# Altium schematic sheet top.SchDoc
size C; SheetNumber: 1; SheetTotal: 3
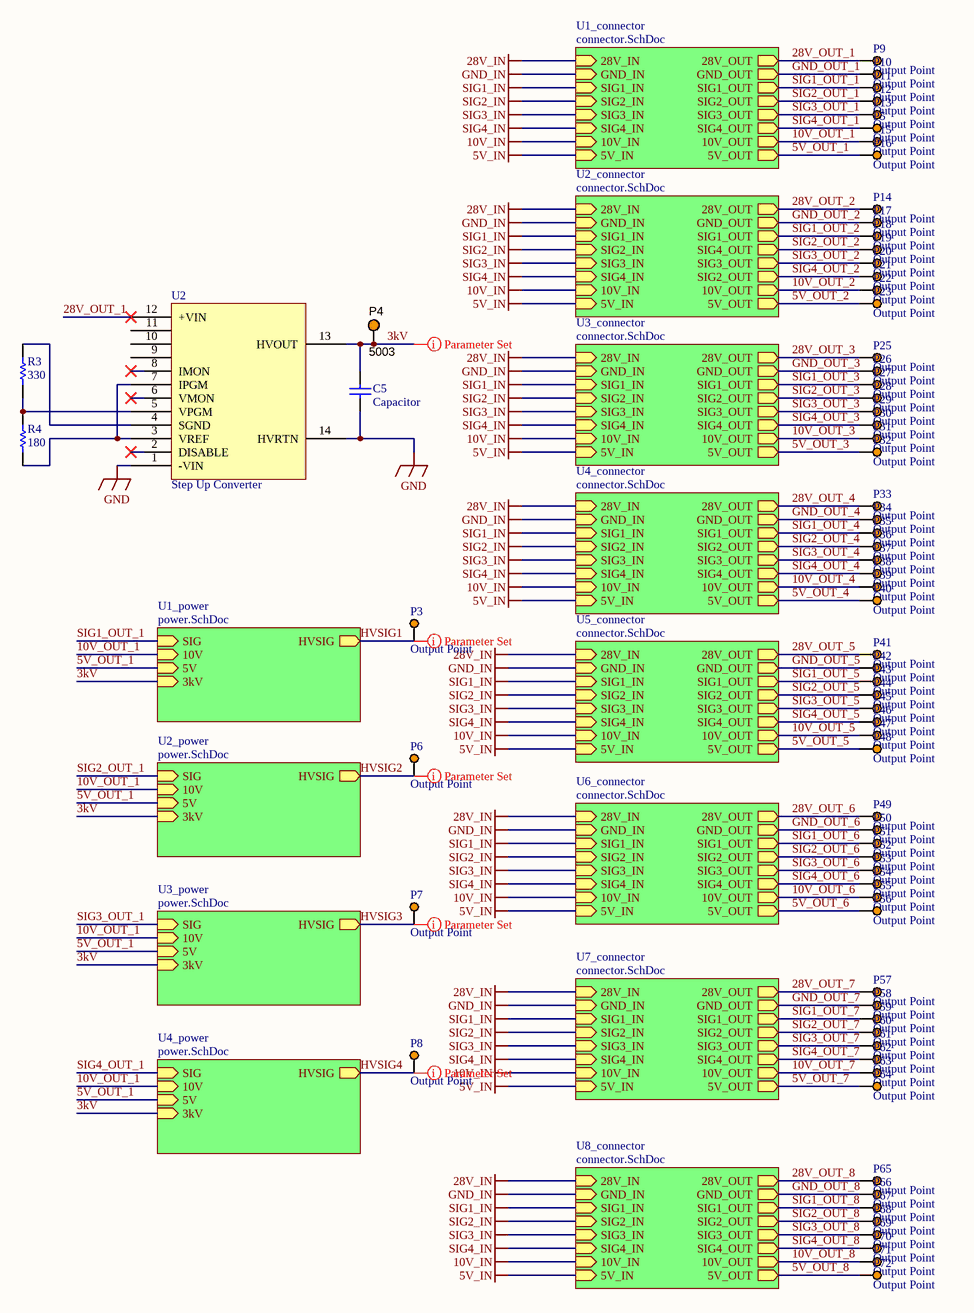
[diagram p0: top.SchDoc]

## Parts
C5  Capacitor  [HV Capacitor]
P3  Output Point  [Via]
P4  5003  [KSTN-5003]
P5  Output Point  [Via]
P6  Output Point  [Via]
P7  Output Point  [Via]
P8  Output Point  [Via]
P9  Output Point  [Via]
P10  Output Point  [Via]
P11  Output Point  [Via]
P12  Output Point  [Via]
P13  Output Point  [Via]
P14  Output Point  [Via]
P15  Output Point  [Via]
P16  Output Point  [Via]
P17  Output Point  [Via]
P18  Output Point  [Via]
P19  Output Point  [Via]
P20  Output Point  [Via]
P21  Output Point  [Via]
P22  Output Point  [Via]
P23  Output Point  [Via]
P25  Output Point  [Via]
P26  Output Point  [Via]
P27  Output Point  [Via]
P28  Output Point  [Via]
P29  Output Point  [Via]
P30  Output Point  [Via]
P31  Output Point  [Via]
P32  Output Point  [Via]
P33  Output Point  [Via]
P34  Output Point  [Via]
P35  Output Point  [Via]
P36  Output Point  [Via]
P37  Output Point  [Via]
P38  Output Point  [Via]
P39  Output Point  [Via]
P40  Output Point  [Via]
P41  Output Point  [Via]
P42  Output Point  [Via]
P43  Output Point  [Via]
P44  Output Point  [Via]
P45  Output Point  [Via]
P46  Output Point  [Via]
P47  Output Point  [Via]
P48  Output Point  [Via]
P49  Output Point  [Via]
P50  Output Point  [Via]
P51  Output Point  [Via]
P52  Output Point  [Via]
P53  Output Point  [Via]
P54  Output Point  [Via]
P55  Output Point  [Via]
P56  Output Point  [Via]
P57  Output Point  [Via]
P58  Output Point  [Via]
P59  Output Point  [Via]
P60  Output Point  [Via]
P61  Output Point  [Via]
P62  Output Point  [Via]
P63  Output Point  [Via]
P64  Output Point  [Via]
P65  Output Point  [Via]
P66  Output Point  [Via]
P67  Output Point  [Via]
P68  Output Point  [Via]
P69  Output Point  [Via]
P70  Output Point  [Via]
P71  Output Point  [Via]
P72  Output Point  [Via]
R3  330  [330 Ohm]
R4  180  [180 Ohm]
U2  Step Up Converter  [Step Up Converter]

## Sub-sheets
U1_connector = connector.SchDoc: 28V_IN (in), GND_IN (in), SIG1_IN (in), SIG2_IN (in), SIG3_IN (in), SIG4_IN (in), 10V_IN (in), 5V_IN (in), 28V_OUT (out), GND_OUT (out), SIG1_OUT (out), SIG2_OUT (out), SIG3_OUT (out), SIG4_OUT (out), 10V_OUT (out), 5V_OUT (out)
U1_power = power.SchDoc: SIG (in), 10V (in), 5V (in), HVSIG (out), 3kV (in)
U2_connector = connector.SchDoc: 28V_IN (in), GND_IN (in), SIG1_IN (in), SIG2_IN (in), SIG3_IN (in), SIG4_IN (in), 10V_IN (in), 5V_IN (in), 28V_OUT (out), GND_OUT (out), SIG1_OUT (out), SIG4_OUT (out), SIG3_OUT (out), SIG2_OUT (out), 10V_OUT (out), 5V_OUT (out)
U2_power = power.SchDoc: SIG (in), 10V (in), 5V (in), HVSIG (out), 3kV (in)
U3_connector = connector.SchDoc: 28V_IN (in), GND_IN (in), SIG1_IN (in), SIG2_IN (in), SIG3_IN (in), SIG4_IN (in), 10V_IN (in), 5V_IN (in), 28V_OUT (out), GND_OUT (out), SIG1_OUT (out), SIG2_OUT (out), SIG3_OUT (out), SIG4_OUT (out), 10V_OUT (out), 5V_OUT (out)
U3_power = power.SchDoc: SIG (in), 10V (in), 5V (in), HVSIG (out), 3kV (in)
U4_connector = connector.SchDoc: 28V_IN (in), GND_IN (in), SIG1_IN (in), SIG2_IN (in), SIG3_IN (in), SIG4_IN (in), 10V_IN (in), 5V_IN (in), 28V_OUT (out), GND_OUT (out), SIG1_OUT (out), SIG2_OUT (out), SIG3_OUT (out), SIG4_OUT (out), 10V_OUT (out), 5V_OUT (out)
U4_power = power.SchDoc: SIG (in), 10V (in), 5V (in), HVSIG (out), 3kV (in)
U5_connector = connector.SchDoc: 28V_IN (in), GND_IN (in), SIG1_IN (in), SIG2_IN (in), SIG3_IN (in), SIG4_IN (in), 10V_IN (in), 5V_IN (in), 28V_OUT (out), GND_OUT (out), SIG1_OUT (out), SIG2_OUT (out), SIG3_OUT (out), SIG4_OUT (out), 10V_OUT (out), 5V_OUT (out)
U6_connector = connector.SchDoc: 28V_IN (in), GND_IN (in), SIG1_IN (in), SIG2_IN (in), SIG3_IN (in), SIG4_IN (in), 10V_IN (in), 5V_IN (in), 28V_OUT (out), GND_OUT (out), SIG1_OUT (out), SIG2_OUT (out), SIG3_OUT (out), SIG4_OUT (out), 10V_OUT (out), 5V_OUT (out)
U7_connector = connector.SchDoc: 28V_IN (in), GND_IN (in), SIG1_IN (in), SIG2_IN (in), SIG3_IN (in), SIG4_IN (in), 10V_IN (in), 5V_IN (in), 28V_OUT (out), GND_OUT (out), SIG1_OUT (out), SIG2_OUT (out), SIG3_OUT (out), SIG4_OUT (out), 10V_OUT (out), 5V_OUT (out)
U8_connector = connector.SchDoc: 28V_IN (in), GND_IN (in), SIG1_IN (in), SIG2_IN (in), SIG3_IN (in), SIG4_IN (in), 10V_IN (in), 5V_IN (in), 28V_OUT (out), GND_OUT (out), SIG1_OUT (out), SIG2_OUT (out), SIG3_OUT (out), SIG4_OUT (out), 10V_OUT (out), 5V_OUT (out)

## Nets
5V_IN: sheet U5_connector/5V_IN, sheet U6_connector/5V_IN, sheet U7_connector/5V_IN, sheet U8_connector/5V_IN, sheet U1_connector/5V_IN, sheet U2_connector/5V_IN, sheet U3_connector/5V_IN, sheet U4_connector/5V_IN
10V_IN: sheet U5_connector/10V_IN, sheet U6_connector/10V_IN, sheet U7_connector/10V_IN, sheet U8_connector/10V_IN, sheet U1_connector/10V_IN, sheet U2_connector/10V_IN, sheet U3_connector/10V_IN, sheet U4_connector/10V_IN
28V_IN: sheet U5_connector/28V_IN, sheet U6_connector/28V_IN, sheet U7_connector/28V_IN, sheet U8_connector/28V_IN, sheet U1_connector/28V_IN, sheet U2_connector/28V_IN, sheet U3_connector/28V_IN, sheet U4_connector/28V_IN
GND: C5.1 U2.1(-VIN) U2.14(HVRTN)
GND_IN: sheet U5_connector/GND_IN, sheet U6_connector/GND_IN, sheet U7_connector/GND_IN, sheet U8_connector/GND_IN, sheet U1_connector/GND_IN, sheet U2_connector/GND_IN, sheet U3_connector/GND_IN, sheet U4_connector/GND_IN
SIG1_IN: sheet U5_connector/SIG1_IN, sheet U6_connector/SIG1_IN, sheet U7_connector/SIG1_IN, sheet U8_connector/SIG1_IN, sheet U1_connector/SIG1_IN, sheet U2_connector/SIG1_IN, sheet U3_connector/SIG1_IN, sheet U4_connector/SIG1_IN
SIG2_IN: sheet U5_connector/SIG2_IN, sheet U6_connector/SIG2_IN, sheet U7_connector/SIG2_IN, sheet U8_connector/SIG2_IN, sheet U1_connector/SIG2_IN, sheet U2_connector/SIG2_IN, sheet U3_connector/SIG2_IN, sheet U4_connector/SIG2_IN
SIG3_IN: sheet U5_connector/SIG3_IN, sheet U6_connector/SIG3_IN, sheet U7_connector/SIG3_IN, sheet U8_connector/SIG3_IN, sheet U1_connector/SIG3_IN, sheet U2_connector/SIG3_IN, sheet U3_connector/SIG3_IN, sheet U4_connector/SIG3_IN
SIG4_IN: sheet U5_connector/SIG4_IN, sheet U6_connector/SIG4_IN, sheet U7_connector/SIG4_IN, sheet U8_connector/SIG4_IN, sheet U1_connector/SIG4_IN, sheet U2_connector/SIG4_IN, sheet U3_connector/SIG4_IN, sheet U4_connector/SIG4_IN
3kV: C5.2 P4.1 U2.13(HVOUT) ; sheet U1_power/3kV, sheet U2_power/3kV, sheet U3_power/3kV, sheet U4_power/3kV
5V_OUT_1: P16.1 ; sheet U1_power/5V, sheet U2_power/5V, sheet U3_power/5V, sheet U4_power/5V, sheet U1_connector/5V_OUT
5V_OUT_2: P23.1 ; sheet U2_connector/5V_OUT
5V_OUT_3: P32.1 ; sheet U3_connector/5V_OUT
5V_OUT_4: P40.1 ; sheet U4_connector/5V_OUT
5V_OUT_5: P48.1 ; sheet U5_connector/5V_OUT
5V_OUT_6: P56.1 ; sheet U6_connector/5V_OUT
5V_OUT_7: P64.1 ; sheet U7_connector/5V_OUT
5V_OUT_8: P72.1 ; sheet U8_connector/5V_OUT
10V_OUT_1: P15.1 ; sheet U1_power/10V, sheet U2_power/10V, sheet U3_power/10V, sheet U4_power/10V, sheet U1_connector/10V_OUT
10V_OUT_2: P22.1 ; sheet U2_connector/10V_OUT
10V_OUT_3: P31.1 ; sheet U3_connector/10V_OUT
10V_OUT_4: P39.1 ; sheet U4_connector/10V_OUT
10V_OUT_5: P47.1 ; sheet U5_connector/10V_OUT
10V_OUT_6: P55.1 ; sheet U6_connector/10V_OUT
10V_OUT_7: P63.1 ; sheet U7_connector/10V_OUT
10V_OUT_8: P71.1 ; sheet U8_connector/10V_OUT
28V_OUT_1: P9.1 U2.12(+VIN) ; sheet U1_connector/28V_OUT
28V_OUT_2: P14.1 ; sheet U2_connector/28V_OUT
28V_OUT_3: P25.1 ; sheet U3_connector/28V_OUT
28V_OUT_4: P33.1 ; sheet U4_connector/28V_OUT
28V_OUT_5: P41.1 ; sheet U5_connector/28V_OUT
28V_OUT_6: P49.1 ; sheet U6_connector/28V_OUT
28V_OUT_7: P57.1 ; sheet U7_connector/28V_OUT
28V_OUT_8: P65.1 ; sheet U8_connector/28V_OUT
GND_OUT_1: P10.1 ; sheet U1_connector/GND_OUT
GND_OUT_2: P17.1 ; sheet U2_connector/GND_OUT
GND_OUT_3: P26.1 ; sheet U3_connector/GND_OUT
GND_OUT_4: P34.1 ; sheet U4_connector/GND_OUT
GND_OUT_5: P42.1 ; sheet U5_connector/GND_OUT
GND_OUT_6: P50.1 ; sheet U6_connector/GND_OUT
GND_OUT_7: P58.1 ; sheet U7_connector/GND_OUT
GND_OUT_8: P66.1 ; sheet U8_connector/GND_OUT
HVSIG1: P3.1 ; sheet U1_power/HVSIG
HVSIG2: P6.1 ; sheet U2_power/HVSIG
HVSIG3: P7.1 ; sheet U3_power/HVSIG
HVSIG4: P8.1 ; sheet U4_power/HVSIG
SIG1_OUT_1: P11.1 ; sheet U1_power/SIG, sheet U1_connector/SIG1_OUT
SIG1_OUT_2: P18.1 ; sheet U2_connector/SIG1_OUT
SIG1_OUT_3: P27.1 ; sheet U3_connector/SIG1_OUT
SIG1_OUT_4: P35.1 ; sheet U4_connector/SIG1_OUT
SIG1_OUT_5: P43.1 ; sheet U5_connector/SIG1_OUT
SIG1_OUT_6: P51.1 ; sheet U6_connector/SIG1_OUT
SIG1_OUT_7: P59.1 ; sheet U7_connector/SIG1_OUT
SIG1_OUT_8: P67.1 ; sheet U8_connector/SIG1_OUT
SIG2_OUT_1: P12.1 ; sheet U2_power/SIG, sheet U1_connector/SIG2_OUT
SIG2_OUT_2: P19.1 ; sheet U2_connector/SIG4_OUT
SIG2_OUT_3: P28.1 ; sheet U3_connector/SIG2_OUT
SIG2_OUT_4: P36.1 ; sheet U4_connector/SIG2_OUT
SIG2_OUT_5: P44.1 ; sheet U5_connector/SIG2_OUT
SIG2_OUT_6: P52.1 ; sheet U6_connector/SIG2_OUT
SIG2_OUT_7: P60.1 ; sheet U7_connector/SIG2_OUT
SIG2_OUT_8: P68.1 ; sheet U8_connector/SIG2_OUT
SIG3_OUT_1: P13.1 ; sheet U3_power/SIG, sheet U1_connector/SIG3_OUT
SIG3_OUT_2: P20.1 ; sheet U2_connector/SIG3_OUT
SIG3_OUT_3: P29.1 ; sheet U3_connector/SIG3_OUT
SIG3_OUT_4: P37.1 ; sheet U4_connector/SIG3_OUT
SIG3_OUT_5: P45.1 ; sheet U5_connector/SIG3_OUT
SIG3_OUT_6: P53.1 ; sheet U6_connector/SIG3_OUT
SIG3_OUT_7: P61.1 ; sheet U7_connector/SIG3_OUT
SIG3_OUT_8: P69.1 ; sheet U8_connector/SIG3_OUT
SIG4_OUT_1: P5.1 ; sheet U4_power/SIG, sheet U1_connector/SIG4_OUT
SIG4_OUT_2: P21.1 ; sheet U2_connector/SIG2_OUT
SIG4_OUT_3: P30.1 ; sheet U3_connector/SIG4_OUT
SIG4_OUT_4: P38.1 ; sheet U4_connector/SIG4_OUT
SIG4_OUT_5: P46.1 ; sheet U5_connector/SIG4_OUT
SIG4_OUT_6: P54.1 ; sheet U6_connector/SIG4_OUT
SIG4_OUT_7: P62.1 ; sheet U7_connector/SIG4_OUT
SIG4_OUT_8: P70.1 ; sheet U8_connector/SIG4_OUT
NetR3_1: R3.1 U2.4(SGND)
NetR3_2: R3.2 R4.1 U2.5(VPGM)
NetR4_2: R4.2 U2.3(VREF) U2.7(IPGM)

Not connected (* = marked no-connect by the designer): U2 2(DISABLE)* 6(VMON)* 8(IMON)* 9 10 11

## Layout directives
rule Clearance Constraint [Generic clearance = 5mm, and 18 value(s) for objects]: 3kV, HVSIG1, HVSIG2, HVSIG3, HVSIG4

## Library data of the parts
P3 P5-P23 P25-P72 = Output Point: Thru hole via
P4 = CMP-002-00037-2: Test Point, Orange, Height 4.6 mm, Tail Length 3 mm, 1-Pin THD, RoHS; Manufacturer: Keystone; Colour: Orange; Packaging: Bulk; Package Description: 1-Pin Through Hole Device, Dia 2.54 mm; Pins: 1; Package Reference: 5003; Datasheet Version: Jun-15; Case/Package: 5003; Mounting Technology: TH; Connector Type: TestPoint; Diameter: 2.54mm; Contact Material: Bronze; Datasheet URL: http://keyelco.com/userAssets/file/M65p56.pdf; Manufacturer URL: http://www.keyelco.com/; Package Quantity: 10; Contact Plating: Tin; RoHS Compliant: True
R3 R4 = Resistor
U2 = Step Up Converter: HRL30